# Altium schematic sheet Sheet_1_2021-01-17.schdoc
size 75 x 35 mm
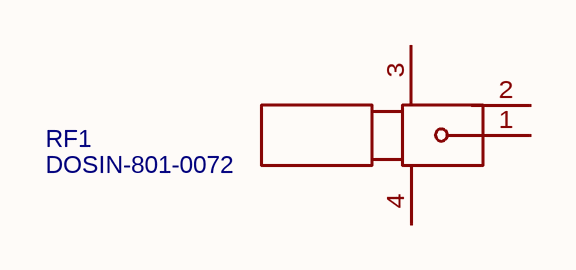
[diagram p0: Sheet_1_2021-01-17.schdoc]

## Parts
RF1  DOSIN-801-0072  [BNC-TH_DOSIN-801-0072]

## Nets

Not connected (* = marked no-connect by the designer): RF1 1 2 3 4

## Library data of the parts
RF1 = DOSIN-801-0072: BOM_Manufacturer: dosinconn; Contributor: LCSC; BOM_Supplier: LCSC; BOM_Supplier Part: C521217; BOM_Manufacturer Part: DOSIN-801-0072; spicePre: R; spiceSymbolName: DOSIN-801-0072